# EAGLE design BigLatchingRelay (EAGLE 7.4.0)
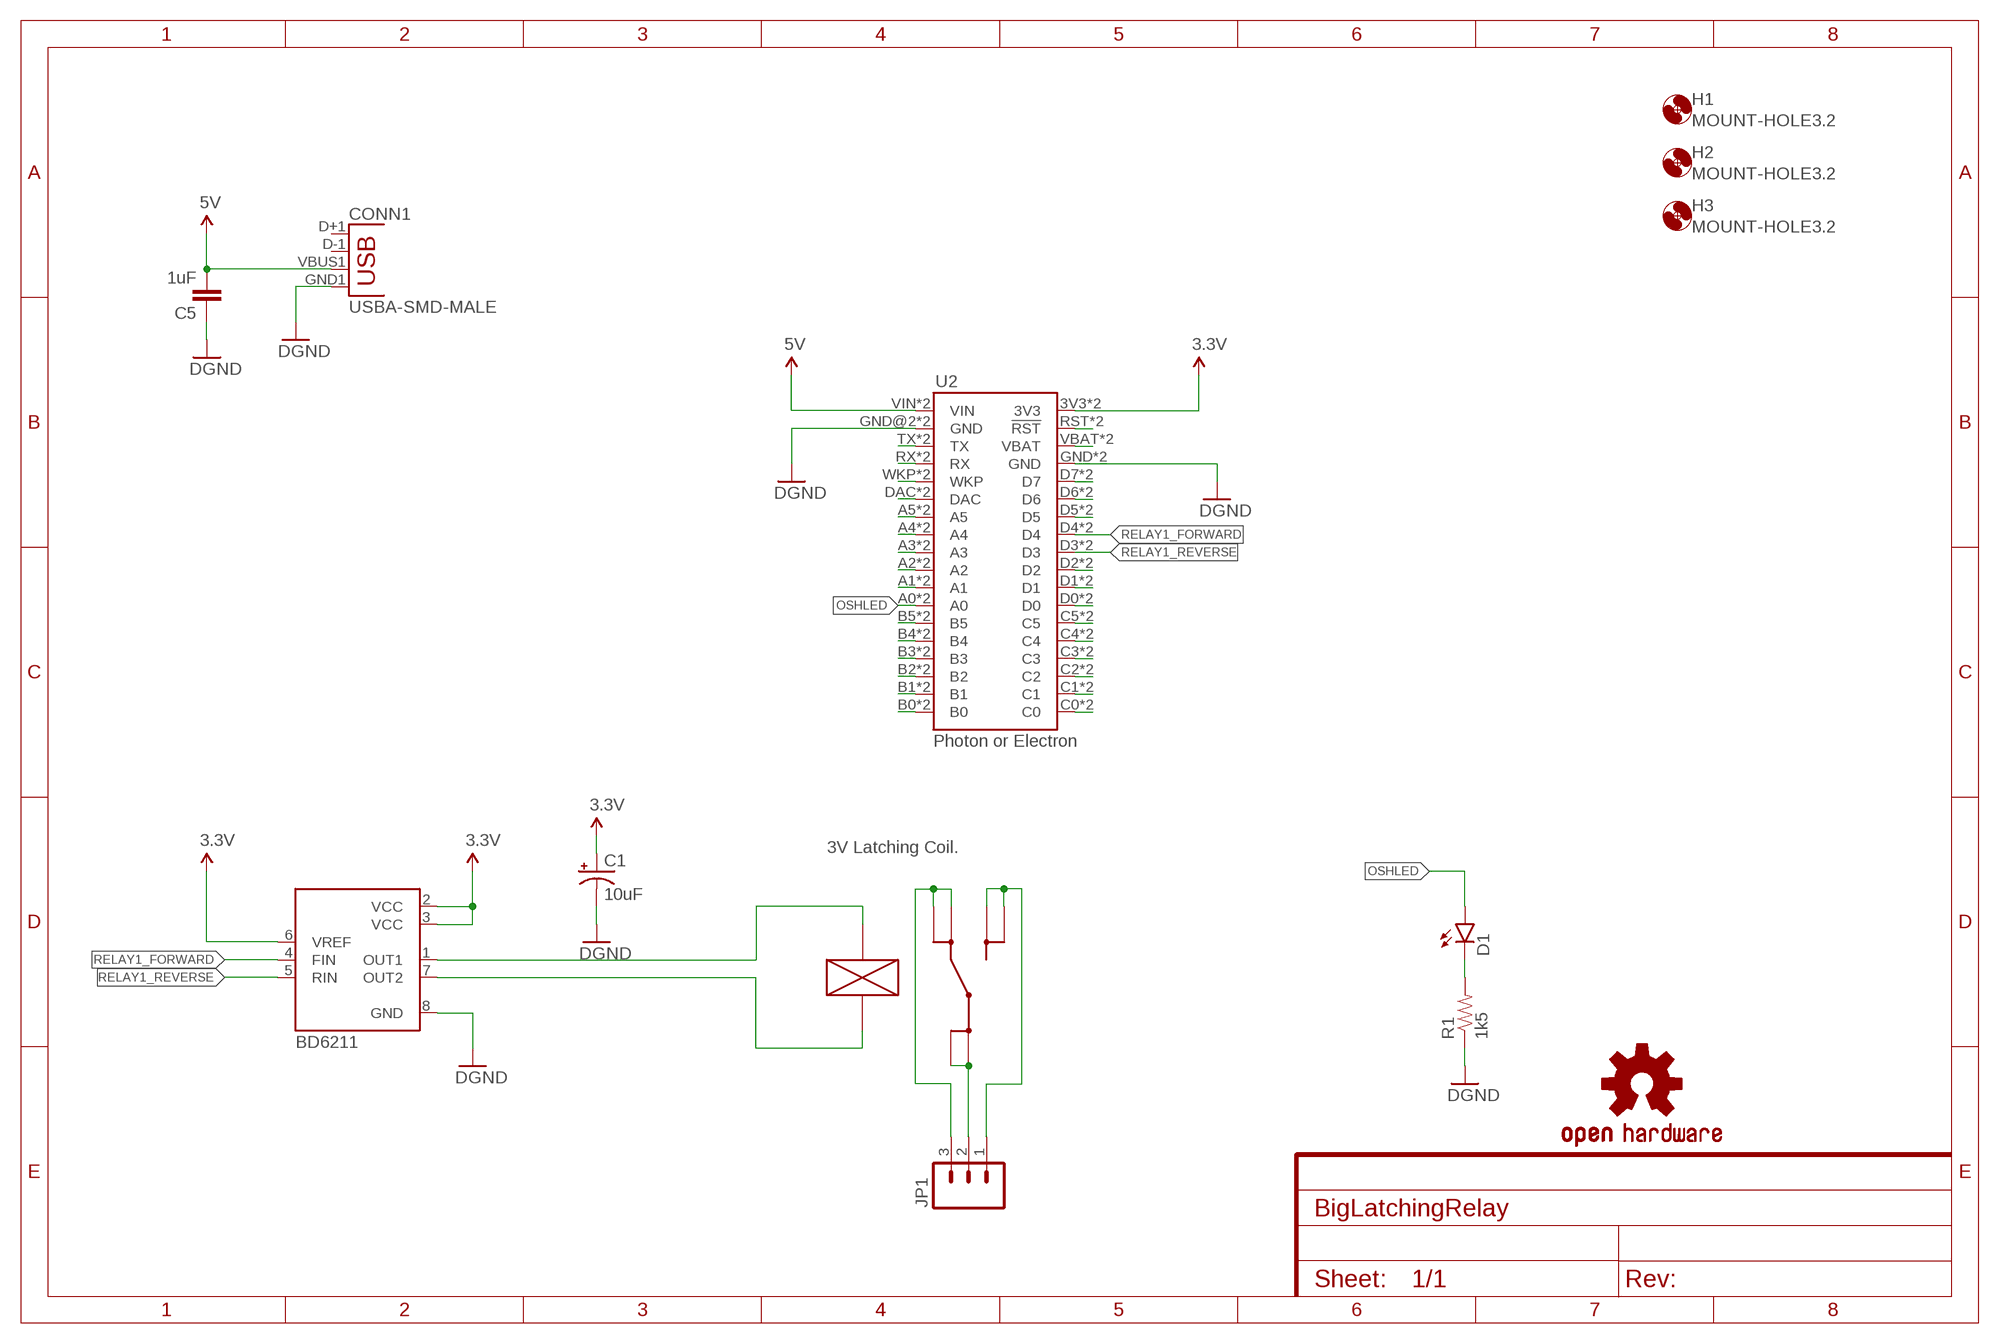
[diagram p0: schematic, sheet 1]

## Parts
C1  10uF  10UF-16V-10%(TANT)  [EIA3216]
C5  1uF  CAP0805  [0805]
CONN1  USBA-SMD-MALE  [USB-A-SMT-MALE]
D1  LED1206-BOTTOM  [LED-1206-BOTTOM]
H1  MOUNT-HOLE3.2  [3,2]
H2  MOUNT-HOLE3.2  [3,2]
H3  MOUNT-HOLE3.2  [3,2]
JP1  M03-SCREW-5MM  [SCREWTERMINAL-5MM-3]
LOGO1  OSHW-LOGOM  [OSHW-LOGO-M]
R1  1k5  RESISTOR1206  [1206]
U2  ELECTRONDUALNAMED  [ELECTRON_SIMPLE_SILK_NAMES_DUAL]
U3  BD6211F  [SOP8]
U$1  RELAY_G5RL-1E  [G5RL-1E]

## Nets
3.3V: C1.A(+) U2.3V3 U2.3V3_1(3V3) U3.2(VCC) U3.3(VCC) U3.6(VREF)
5V: C5.2 CONN1.VBUS1(VBUS) U2.VIN U2.VIN_1B(VIN)
GND: C1.C(-) C5.1 CONN1.GND1(GND) R1.1 U2.GND U2.GND@2(GND) U2.GND_1(GND) U2.GND_1B(GND) U3.8(GND) ; supply symbol labelled DGND
N$1: JP1.2 U$1.COM@1(COM) U$1.COM@2(COM)
N$3: JP1.1 U$1.NO@1(NO) U$1.NO@2(NO)
N$4: JP1.3 U$1.NC@1(NC) U$1.NC@2(NC)
N$6: U2.VBAT U2.VBATT_1(VBAT)
N$7: U2.RST(!RST) U2.RST_1(!RST)
N$11: D1.C R1.2
N$12: U3.1(OUT1) U$1.COIL+
N$13: U3.7(OUT2) U$1.COIL-
N$15: U2.D6 U2.D6_1(D6)
N$16: U2.D5 U2.D5_1(D5)
N$20: U2.D2 U2.D2_1(D2)
N$21: U2.D1 U2.D1_1(D1)
N$22: U2.D0 U2.D0_1(D0)
N$23: U2.C5 U2.C5_1(C5)
N$24: U2.C4 U2.C4_1(C4)
N$25: U2.C3 U2.C3_1(C3)
N$26: U2.C2 U2.C2_1(C2)
N$28: U2.C1 U2.C1_1(C1)
N$29: U2.C0 U2.C0_1(C0)
N$31: U2.B0 U2.B0_1(B0)
N$33: U2.B1 U2.B1_1(B1)
N$35: U2.B2 U2.B2_1(B2)
N$36: U2.B3 U2.B3_1(B3)
N$37: U2.B4 U2.B4_1(B4)
N$38: U2.B5 U2.B5_1(B5)
N$39: U2.D7 U2.D7_1(D7)
N$40: U2.A1 U2.A1_1(A1)
N$41: U2.A2 U2.A2_1(A2)
N$42: U2.A3 U2.A3_1(A3)
N$43: U2.A4 U2.A4_1(A4)
N$44: U2.A5 U2.A5_1(A5)
N$45: U2.DAC U2.DAC_1(DAC)
N$46: U2.WKP U2.WKP_1(WKP)
N$47: U2.RX U2.RX_1(RX)
N$48: U2.TX U2.TX_1(TX)
OSHLED: D1.A U2.A0 U2.A0_1(A0)
RELAY1_FORWARD: U2.D4 U2.D4_1(D4) U3.4(FIN)
RELAY1_REVERSE: U2.D3 U2.D3_1(D3) U3.5(RIN)
Unconnected: CONN1.D+1(D+) CONN1.D-1(D-)

## Notes on the sheet
- Photon or Electron
- 3V Latching Coil.
- BD6211

## Library data of the parts
C1 = SparkFun-Capacitors:10UF-16V-10%(TANT): CAP-00811 1206/EIA-3216 Tantalum capacitor; PROD_ID: CAP-00811
C5 = SparkFun-Passives:CAP: Capacitor Standard 0603 ceramic capacitor, and 0.1" leaded capacitor.
CONN1 = SparkFun-Connectors:USB: USB Connectors USB-B-PTH is fully proven SKU : PRT-00139/CONN-08278 USB-miniB is fully proven SKU : PRT-00587 USB-A-PCB is untested. USB-A-H is throughly reviewed, but untested. Spark Fun Electronics SKU : PRT-00437 USB-B-SMT is throughly reviewed, but untested. Needs silkscreen touching up. USB-A-S has not been used/tested USB-MB-H has not been used/tested USB-MICROB has been used. CONN-09505
D1 = SparkFun-LED:LED: LEDs Standard schematic elements and footprints for 5mm, 3mm, 1206, and 0603 sized LEDs. 5mm - Spark Fun Electronics SKU : COM-00529 (and others)
H1-H3 = holes:MOUNT-HOLE: MOUNTING HOLE with drill center marker
JP1 = SparkFun-Connectors:M03: Header 3 Standard 3-pin 0.1" header. Use with straight break away headers (SKU : PRT-00116), right angle break away headers (PRT-00553), swiss pins (PRT-00743), machine pins (PRT-00117), and female headers (PRT-00115). Molex polarized connector foot print use with SKU : PRT-08232 with associated crimp pins and housings.; STOREFRONT_ID: PRT-08433
LOGO1 = SparkFun-Aesthetics:OSHW-LOGO: Open Source Hardware Logo This logo indicates the piece of hardware it is found on incorporates a OSHW license and/or adheres to the definition of open source hardware found here: http://freedomdefined.org/OSHW
R1 = SparkFun-Resistors:RESISTOR: Resistor Basic schematic elements and footprints for 0603, 1206, and PTH resistors.
U2 = Tinamous:ELECTRON
U3 = BD6211F:BD6211F
U$1 = RELAY_G5RL-1E:RELAY_G5RL-1E

## Board
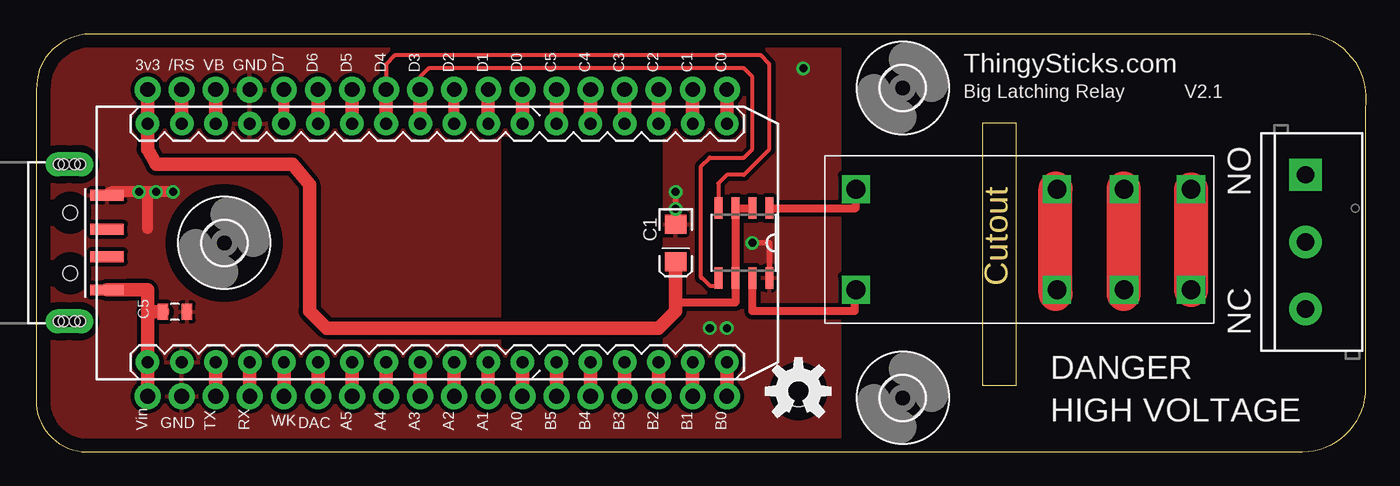
[diagram p1: board, top side]
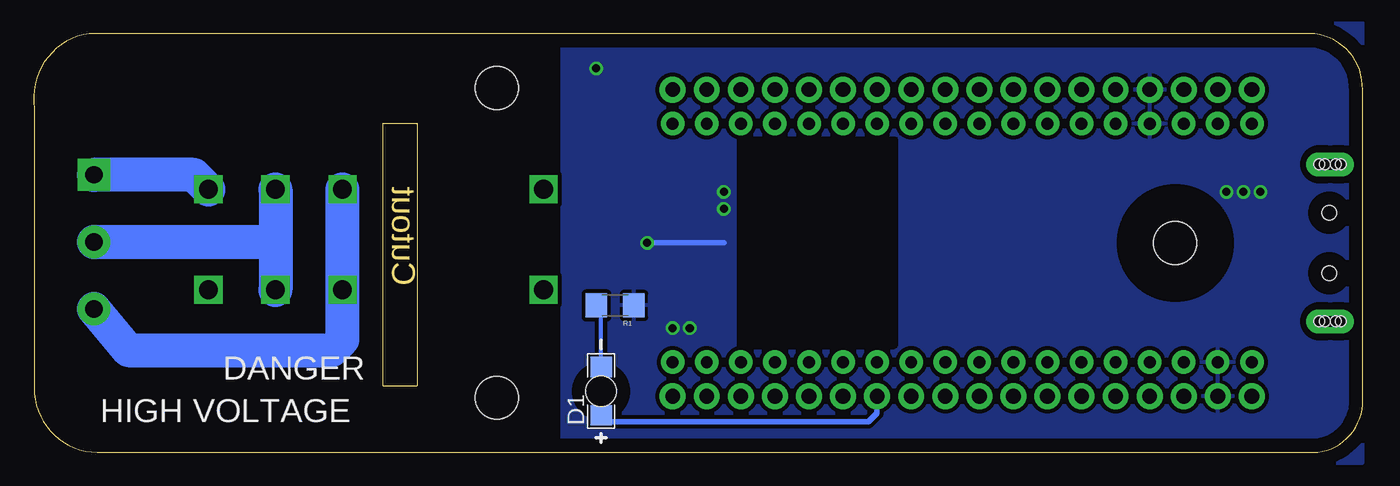
[diagram p2: board, bottom side, seen from below]

Size 99.09 x 31.22 mm. Coordinates in mm from the lower left corner, seen from the top.
Outline: 3.92,31.22 94.95,31.22 arc-90 99.04,25.66 99.04,4.82 arc-90 94.34,0.01 4.06,0.01 arc-90 0,3.55 0,27.04 arc-90 3.92,31.22
Outline: 70.48,24.52 70.48,4.97 73.03,4.97 73.03,24.52 70.48,24.52
Copper layers (1*16): Top 0.035mm / dielectric 1.5mm / Bottom 0.035mm
Design rules "default": minimum track width 10mil, minimum drill 24mil, track to track 8mil, track to pad 8mil, pad to pad 8mil, via to via 8mil, smd to smd 8mil, copper to edge 40mil, drill to drill 8mil, minimum pad ring 10mil, minimum via ring 8mil, stop-mask expansion 4mil, vias tented up to drill 0mil, thermal gap 10mil
tRestrict: area 34.9,8 to 46.4,23.2
bRestrict: area 34.9,8 to 46.4,23.2

### Footprints (pad centres in the part's own frame; a part is rotated, then mirrored left to right if it is on the bottom)
EIA3216 = smd 1.4 x 1.6: A 1.4,0; C -1.4,0
0805 = smd 0.8 x 1.2: 1 -0.9,0; 2 0.9,0
USB-A-SMT-MALE = smd 0.8 x 2.5: D+1 1.027,-5.87; D-1 -1.027,-5.87; GND1 3.551,-5.87; VBUS1 -3.5,-5.87 | drill 0.8 pad 1.778 long: P$1 5.85,-3.05; P$3 -5.85,-3.05 | hole 1.1: 2.25,-3.12; -2.25,-3.12 | hole 0.8: -5.85,-3.45; -5.85,-3.85; -5.85,-2.65; -5.85,-2.25; 5.85,-3.45; 5.85,-3.85; 5.85,-2.65; 5.85,-2.25
LED-1206-BOTTOM = smd 1.5 x 1.6: A -1.8,0; C 1.8,0 | hole 2.3: 0,0
3,2 = hole 3.2: 0,0
SCREWTERMINAL-5MM-3 = drill 1.3 pad 2.413 square: 1 0,0 | drill 1.3 pad 2.413: 2 5,0; 3 10,0
1206 = smd 1.6 x 1.8: 1 -1.4,0; 2 1.4,0
ELECTRON_SIMPLE_SILK_NAMES_DUAL = drill 0.889 pad 1.753: 3V3 1.27,22.86; A0 29.21,5.08; A1 26.67,5.08; A2 24.13,5.08; A3 21.59,5.08; A4 19.05,5.08; A5 16.51,5.08; B0 44.45,5.08; B1 41.91,5.08; B2 39.37,5.08; B3 36.83,5.08; B4 34.29,5.08; B5 31.75,5.08; C0 44.45,22.86; C1 41.91,22.86; C2 39.37,22.86; C3 36.83,22.86; C4 34.29,22.86; C5 31.75,22.86; D0 29.21,22.86; D1 26.67,22.86; D2 24.13,22.86; D3 21.59,22.86; D4 19.05,22.86; D5 16.51,22.86; D6 13.97,22.86; D7 11.43,22.86; DAC 13.97,5.08; GND 8.89,22.86; GND@2 3.81,5.08; RST 3.81,22.86; RX 8.89,5.08; TX 6.35,5.08; VBAT 6.35,22.86; VIN 1.27,5.08; WKP 11.43,5.08 | drill 1.1 pad 1.93: 3V3_1 1.27,25.4; A0_1 29.21,2.54; A1_1 26.67,2.54; A2_1 24.13,2.54; A3_1 21.59,2.54; A4_1 19.05,2.54; A5_1 16.51,2.54; B0_1 44.45,2.54; B1_1 41.91,2.54; B2_1 39.37,2.54; B3_1 36.83,2.54; B4_1 34.29,2.54; B5_1 31.75,2.54; C0_1 44.45,25.4; C1_1 41.91,25.4; C2_1 39.37,25.4; C3_1 36.83,25.4; C4_1 34.29,25.4; C5_1 31.75,25.4; D0_1 29.21,25.4; D1_1 26.67,25.4; D2_1 24.13,25.4; D3_1 21.59,25.4; D4_1 19.05,25.4; D5_1 16.51,25.4; D6_1 13.97,25.4; D7_1 11.43,25.4; DAC_1 13.97,2.54; GND_1 8.89,25.4; GND_1B 3.81,2.54; RST_1 3.81,25.4; RX_1 8.89,2.54; TX_1 6.35,2.54; VBATT_1 6.35,25.4; VIN_1B 1.27,2.54; WKP_1 11.43,2.54
SOP8 = smd 0.6 x 1.6: 1 -1.905,-2.6; 2 -0.635,-2.6; 3 0.635,-2.6; 4 1.905,-2.6; 5 1.905,2.6; 6 0.635,2.6; 7 -0.635,2.6; 8 -1.905,2.6
G5RL-1E = drill 1.4 square: COIL+ -10.7,4; COIL- -10.7,-3.5; COM@1 9.3,4; COM@2 9.3,-3.5; NC@1 4.3,4; NC@2 4.3,-3.5; NO@1 14.3,4; NO@2 14.3,-3.5

### Placement (x,y rotation side)
C1  47.62,15.61 270 top
C5  10.29,10.47 180 top
CONN1  -0.63,15.61 90 top
D1  56.77,4.57 90 bottom
H1  13.97,15.61 0 top
H2  64.56,27.16 0 top
H3  64.56,4.07 180 top
JP1  94.59,20.69 270 top
LOGO1  56.77,4.57 0 top
R1  55.73,10.96 180 bottom
U2  6.99,1.64 0 top
U3  52.7,15.61 180 top
U$1  71.76,15.61 0 top

### Tracks (layer width: path | path; a pad name or v marks a point on that pad's centre or on a via)
3.3V
  Top 0.61: U3.2 U3.3 U3.6 52.07,11.17 47.62,11.17 C1.A
  Top 1.016: C1.A 47.62,10.53 46.35,9.26 21.59,9.26 20.32,10.53 20.32,19.94 19.05,21.46 8.89,21.46 8.26,22.6 U2.3V3 U2.3V3_1
5V
  Top 0.813: 8.32,12.11 8.26,12.11 | 8.26,10.47 8.26,10.53
  Top 1.016: CONN1.VBUS1 6.35,12.11 6.67,12.11 8.26,12.11 8.26,10.53 U2.VIN U2.VIN_1B | C5.2 8.26,10.47
GND  (via drill 0.6)
  Top 0.406: U3.8 54.61,15.61 v53.34,15.61 | v47.62,19.42 C1.C
  Top 0.813: v10.16,19.42 v8.89,19.42 8.26,19.42 | 8.26,19.42 v7.62,19.42 5.49,19.42 CONN1.GND1 | 8.26,16.7 8.26,19.42
  Bottom 0.406: v53.34,15.61 47.62,15.61
  other vias: 51.43,9.26 50.16,9.26 57.15,28.63 47.62,18.15
  pour Bottom (isolate 0.305): 0,32 59.69,31.36 59.69,-0.26 37.85,-0.77 0,-0.77
  pour Top (isolate 0.305): -1.27,32.76 59.8,32.76 59.8,-0.9 -1.27,-0.9
N$1
  Bottom 2.54: JP1.2 81.06,15.69 | U$1.COM@1 81.06,15.69 | U$1.COM@2 81.06,15.61 81.06,15.69
N$3
  Top 2.54: U$1.NO@2 U$1.NO@1
  Bottom 2.54: U$1.NO@1 87.14,20.69 JP1.1
N$4
  Bottom 2.54: U$1.NC@1 U$1.NC@2 76.06,8.41 76.84,7.63 92.03,7.63 JP1.3
N$6
  Top 1.016: U2.VBAT U2.VBATT_1
N$7
  Top 1.016: U2.RST U2.RST_1
N$11
  Bottom 0.305: D1.C 56.77,10.75 R1.2
N$12
  Top 0.61: U3.1 61.05,18.21 U$1.COIL+
N$13
  Top 0.61: U$1.COIL- 60.96,12.11 60.96,10.53 53.34,10.53 U3.7
N$15
  Top 1.016: U2.D6 U2.D6_1
N$16
  Top 1.016: U2.D5 U2.D5_1
N$19
  Top 2.54: 75.95,11.82 75.95,19.67
N$20
  Top 0.813: U2.D2 U2.D2_1
N$21
  Top 1.016: U2.D1 U2.D1_1
N$22
  Top 1.016: U2.D0_1 U2.D0
N$23
  Top 1.016: U2.C5_1 U2.C5
N$24
  Top 1.016: U2.C4_1 U2.C4
N$25
  Top 1.016: U2.C3_1 U2.C3
N$26
  Top 1.016: U2.C2_1 U2.C2
N$27
  Top 2.54: 81.03,11.82 81.03,19.67
N$28
  Top 1.016: U2.C1_1 U2.C1
N$29
  Top 1.016: U2.C0_1 U2.C0
N$31
  Top 1.016: U2.B0_1 U2.B0
N$33
  Top 1.016: U2.B1 U2.B1_1
N$35
  Top 1.016: U2.B2_1 U2.B2
N$36
  Top 1.016: U2.B3 U2.B3_1
N$37
  Top 1.016: U2.B4_1 U2.B4
N$38
  Top 1.016: U2.B5 U2.B5_1
N$39
  Top 0.813: U2.D7 U2.D7_1
N$40
  Top 1.016: U2.A1 U2.A1_1
N$41
  Top 1.016: U2.A2_1 U2.A2
N$42
  Top 1.016: U2.A3 U2.A3_1
N$43
  Top 1.016: U2.A4_1 U2.A4
N$44
  Top 1.016: U2.A5 U2.A5_1
N$45
  Top 1.016: U2.DAC_1 U2.DAC
N$46
  Top 1.016: U2.WKP U2.WKP_1
N$47
  Top 1.016: U2.RX_1 U2.RX
N$48
  Top 1.016: U2.TX U2.TX_1
OSHLED
  Top 1.016: U2.A0_1 U2.A0
  Bottom 0.406: U2.A0_1 36.2,2.91 36.83,2.28 56.41,2.28 D1.A
RELAY1_FORWARD
  Top 0.305: U2.D4_1 26.03,28.95 26.67,29.58 53.98,29.58 54.61,28.95 54.61,22.6 52.7,20.69 51.43,20.69 50.8,20.06 U3.4
  Top 1.016: U2.D4 U2.D4_1
RELAY1_REVERSE
  Top 0.305: U2.D3_1 28.57,27.99 29.21,28.63 52.7,28.63 53.34,27.99 53.34,22.6 52.7,21.96 50.16,21.96 49.53,21.33 49.53,13.01 49.59,13.01 50.16,12.44 50.8,12.44
  Top 0.406: 50.8,12.44 U3.5
  Top 1.016: U2.D3 U2.D3_1

### Text on the board
Dimension: Cutout
tNames: ThingySticks.com | Big Latching Relay | V2.1 | NO | NC | DANGER | HIGH VOLTAGE
bNames: DANGER | HIGH VOLTAGE